# Altium schematic sheet Sheet4.SchDoc
size A3
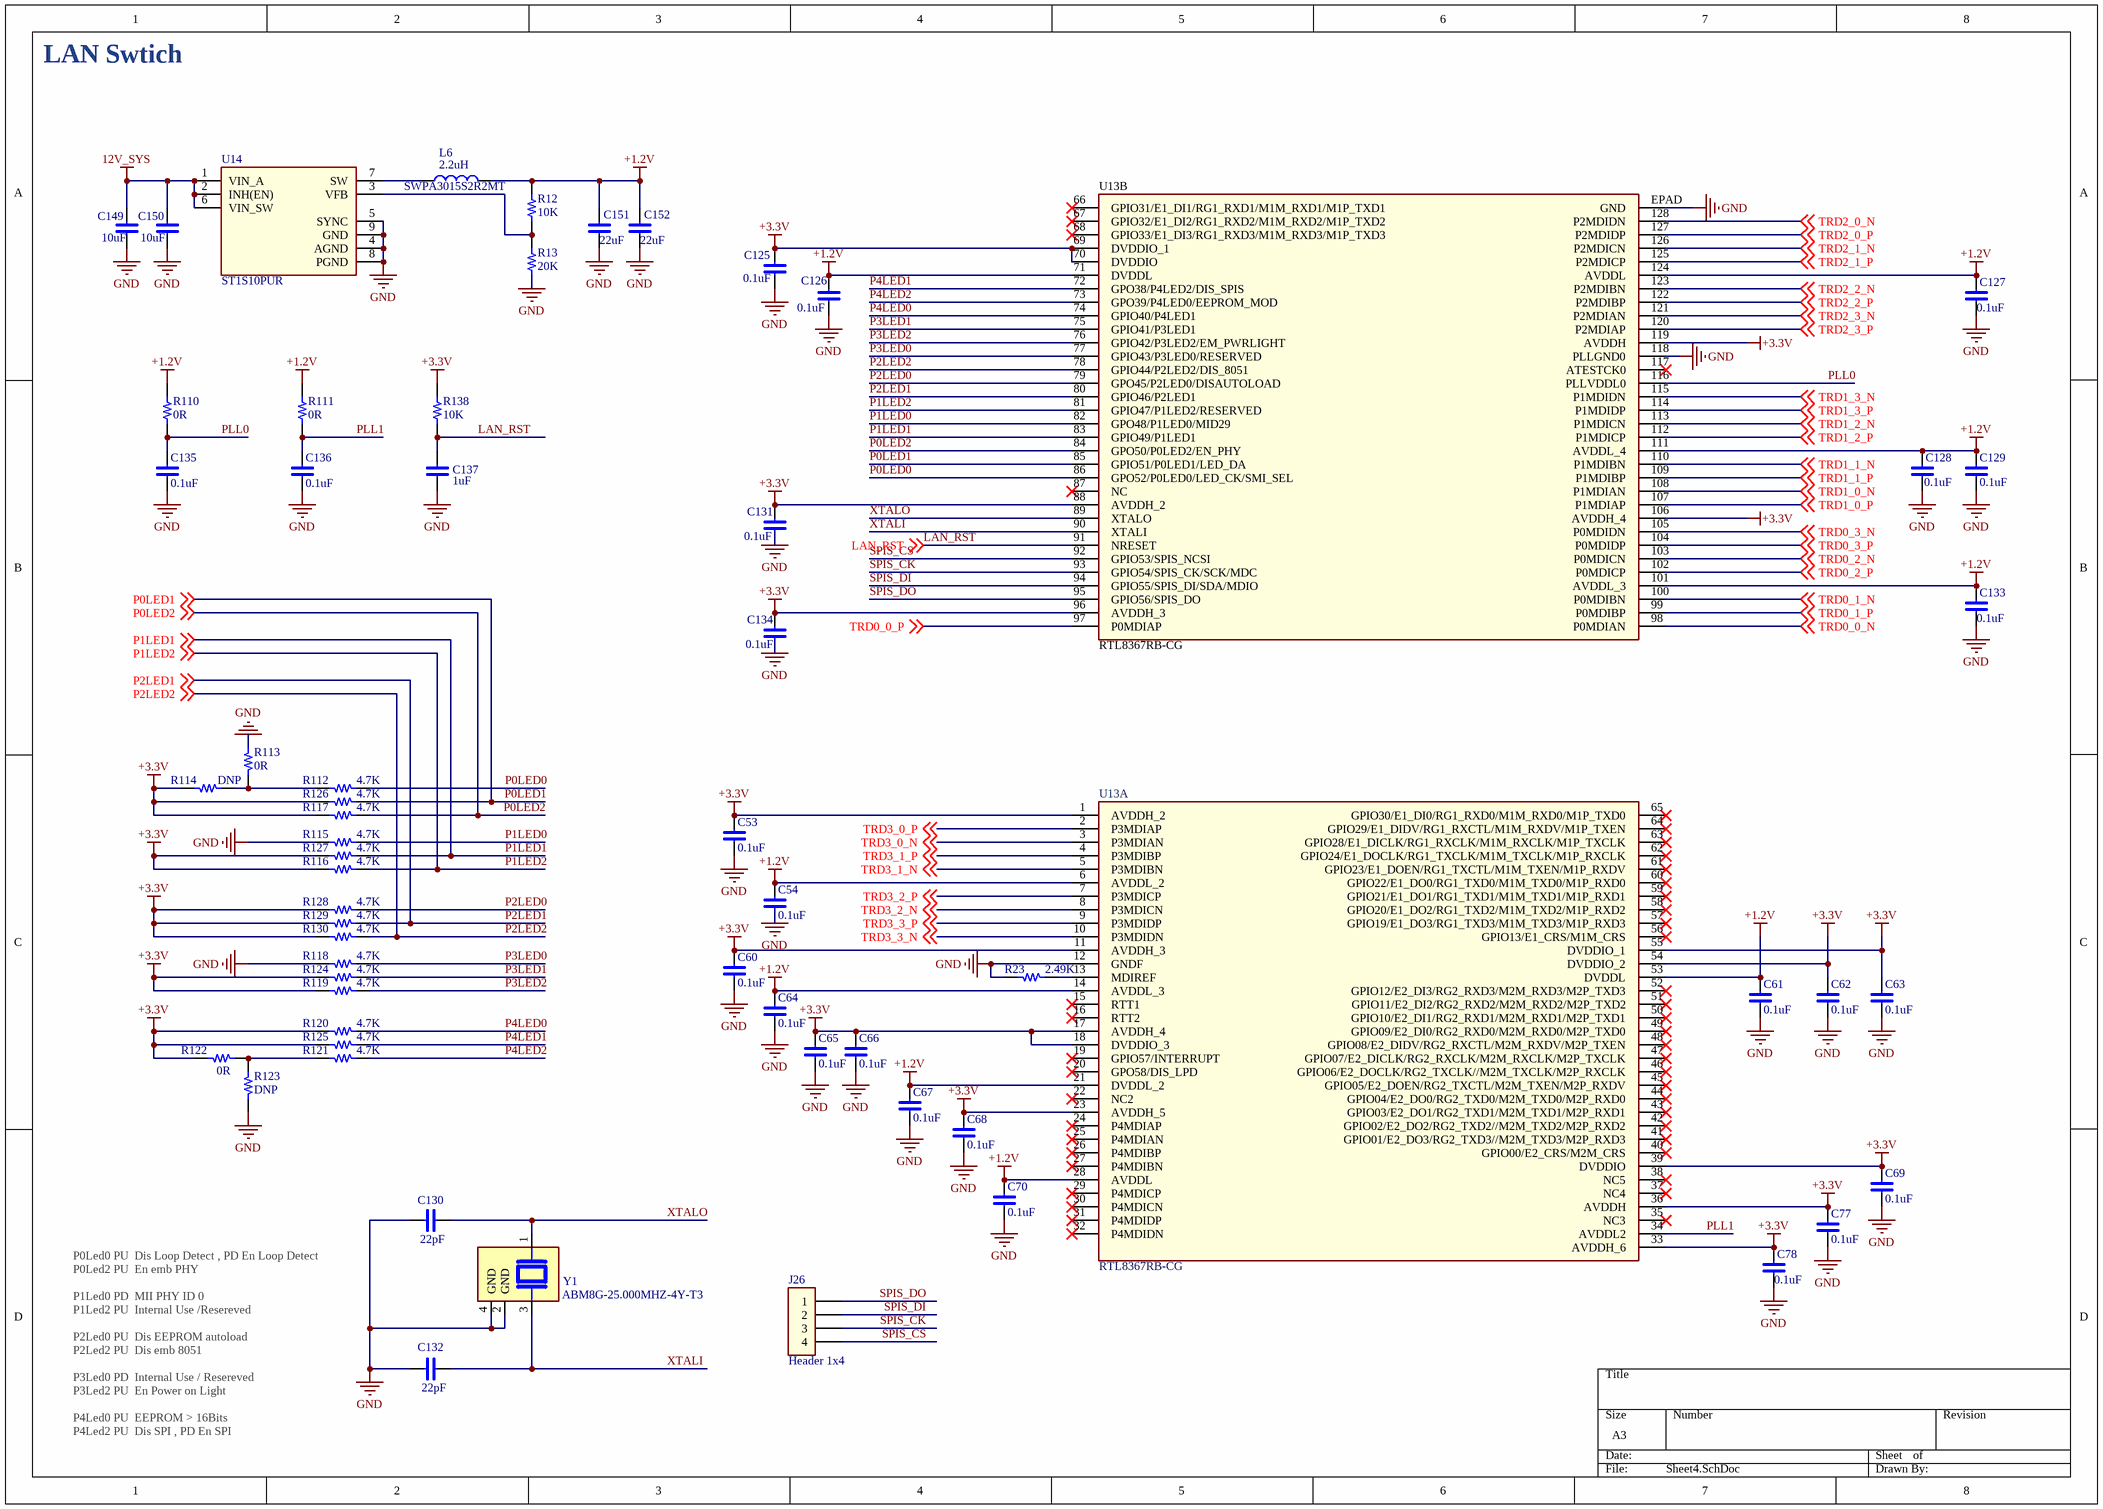
[diagram p0: Sheet4.SchDoc]

## Parts
C53  0.1uF  [C-0402/1005]
C54  0.1uF  [C-0402/1005]
C60  0.1uF  [C-0402/1005]
C61  0.1uF  [C-0402/1005]
C62  0.1uF  [C-0402/1005]
C63  0.1uF  [C-0402/1005]
C64  0.1uF  [C-0402/1005]
C65  0.1uF  [C-0402/1005]
C66  0.1uF  [C-0402/1005]
C67  0.1uF  [C-0402/1005]
C68  0.1uF  [C-0402/1005]
C69  0.1uF  [C-0402/1005]
C70  0.1uF  [C-0402/1005]
C77  0.1uF  [C-0402/1005]
C78  0.1uF  [C-0402/1005]
C125  0.1uF  [C-0402/1005]
C126  0.1uF  [C-0402/1005]
C127  0.1uF  [C-0402/1005]
C128  0.1uF  [C-0402/1005]
C129  0.1uF  [C-0402/1005]
C130  22pF  [C-0402/1005]
C131  0.1uF  [C-0402/1005]
C132  22pF  [C-0402/1005]
C133  0.1uF  [C-0402/1005]
C134  0.1uF  [C-0402/1005]
C135  0.1uF  [C-0402/1005]
C136  0.1uF  [C-0402/1005]
C137  1uF  [C-0402/1005]
C149  10uF  [C-0805/2012]
C150  10uF  [C-0805/2012]
C151  22uF  [C-0805/2012]
C152  22uF  [C-0805/2012]
J26  Header 1x4  [PIN HEADER 1x4 2.54mm]
L6  SWPA3015S2R2MT  value 2.2uH  [SWPA3015S2R2MT]
R12  10K  [R-0402/1005]
R13  20K  [R-0402/1005]
R23  2.49K  [R-0402/1005]
R110  0R  [R-0402/1005]
R111  0R  [R-0402/1005]
R112  4.7K  [R-0402/1005]
R113  0R  [R-0402/1005]
R114  DNP  [R-0402/1005]
R115  4.7K  [R-0402/1005]
R116  4.7K  [R-0402/1005]
R117  4.7K  [R-0402/1005]
R118  4.7K  [R-0402/1005]
R119  4.7K  [R-0402/1005]
R120  4.7K  [R-0402/1005]
R121  4.7K  [R-0402/1005]
R122  0R  [R-0402/1005]
R123  DNP  [R-0402/1005]
R124  4.7K  [R-0402/1005]
R125  4.7K  [R-0402/1005]
R126  4.7K  [R-0402/1005]
R127  4.7K  [R-0402/1005]
R128  4.7K  [R-0402/1005]
R129  4.7K  [R-0402/1005]
R130  4.7K  [R-0402/1005]
R138  10K  [R-0402/1005]
U13  RTL8367RB-CG  [LQFP128_EPAD_RTK]  (parts A,B of 2)
U14  ST1S10PUR  [DFN8_4X4_STM]
Y1  ABM8G-25.000MHZ-4Y-T3  [XTAL_ABM8G-25.000MHZ-4Y-T3]

## Nets
12V_SYS: C149.1 C150.1 U14.1(VIN_A) U14.2(INH(EN)) U14.6(VIN_SW)
+1.2V: C54.1 C61.1 C64.1 C67.1 C70.1 C126.1 C127.1 C128.1 C129.1 C133.1 C151.1 C152.1 L6.2 R12.2 R110.2 R111.2 U13.6(AVDDL_2) U13.14(AVDDL_3) U13.21(DVDDL_2) U13.28(AVDDL) U13.53(DVDDL) U13.71(DVDDL) U13.101(AVDDL_3) U13.111(AVDDL_4) U13.124(AVDDL)
+3.3V: C53.1 C60.1 C62.1 C63.1 C65.1 C66.1 C68.1 C69.1 C77.1 C78.1 C125.1 C131.1 C134.1 R114.2 R116.2 R117.2 R119.2 R120.2 R122.2 R124.2 R125.2 R126.2 R127.2 R128.2 R129.2 R130.2 R138.2 U13.1(AVDDH_2) U13.11(AVDDH_3) U13.17(AVDDH_4) U13.18(DVDDIO_3) U13.23(AVDDH_5) U13.33(AVDDH_6) U13.36(AVDDH) U13.39(DVDDIO) U13.54(DVDDIO_2) U13.55(DVDDIO_1) U13.69(DVDDIO_1) U13.70(DVDDIO) U13.88(AVDDH_2) U13.96(AVDDH_3) U13.106(AVDDH_4) U13.119(AVDDH)
GND: C53.2 C54.2 C60.2 C61.2 C62.2 C63.2 C64.2 C65.2 C66.2 C67.2 C68.2 C69.2 C70.2 C77.2 C78.2 C125.2 C126.2 C127.2 C128.2 C129.2 C130.1 C131.2 C132.1 C133.2 C134.2 C135.2 C136.2 C137.2 C149.2 C150.2 C151.2 C152.2 R13.2 R23.2 R113.2 R115.2 R118.2 R123.2 U13.12(GNDF) U13.118(PLLGND0) U13.EPAD(GND) U14.4(AGND) U14.5(SYNC) U14.8(PGND) U14.9(GND) Y1.2(GND) Y1.4(GND)
LAN_RST: C137.1 R138.1 U13.91(NRESET) ; off-sheet LAN_RST
P0LED0: R112.1 U13.86(GPO52/P0LED0/LED_CK/SMI_SEL)
P0LED1: R126.1 U13.85(GPIO51/P0LED1/LED_DA) ; off-sheet P0LED1
P0LED2: R117.1 U13.84(GPO50/P0LED2/EN_PHY) ; off-sheet P0LED2
P1LED0: R115.1 U13.82(GPO48/P1LED0/MID29)
P1LED1: R127.1 U13.83(GPIO49/P1LED1) ; off-sheet P1LED1
P1LED2: R116.1 U13.81(GPIO47/P1LED2/RESERVED) ; off-sheet P1LED2
P2LED0: R128.1 U13.79(GPO45/P2LED0/DISAUTOLOAD)
P2LED1: R129.1 U13.80(GPIO46/P2LED1) ; off-sheet P2LED1
P2LED2: R130.1 U13.78(GPIO44/P2LED2/DIS_8051) ; off-sheet P2LED2
P3LED0: R118.1 U13.77(GPIO43/P3LED0/RESERVED)
P3LED1: R124.1 U13.75(GPIO41/P3LED1)
P3LED2: R119.1 U13.76(GPIO42/P3LED2/EM_PWRLIGHT)
P4LED0: R120.1 U13.74(GPIO40/P4LED1)
P4LED1: R125.1 U13.72(GPO38/P4LED2/DIS_SPIS)
P4LED2: R121.1 U13.73(GPO39/P4LED0/EEPROM_MOD)
PLL0: C135.1 R110.1 U13.116(PLLVDDL0)
PLL1: C136.1 R111.1 U13.34(AVDDL2)
SPIS_CK: J26.3 U13.93(GPIO54/SPIS_CK/SCK/MDC)
SPIS_CS: J26.4 U13.92(GPIO53/SPIS_NCSI)
SPIS_DI: J26.2 U13.94(GPIO55/SPIS_DI/SDA/MDIO)
SPIS_DO: J26.1 U13.95(GPIO56/SPIS_DO)
TRD0_0_N: U13.98(P0MDIAN) ; off-sheet TRD0_0_N
TRD0_0_P: U13.97(P0MDIAP) ; off-sheet TRD0_0_P
TRD0_1_N: U13.100(P0MDIBN) ; off-sheet TRD0_1_N
TRD0_1_P: U13.99(P0MDIBP) ; off-sheet TRD0_1_P
TRD0_2_N: U13.103(P0MDICN) ; off-sheet TRD0_2_N
TRD0_2_P: U13.102(P0MDICP) ; off-sheet TRD0_2_P
TRD0_3_N: U13.105(P0MDIDN) ; off-sheet TRD0_3_N
TRD0_3_P: U13.104(P0MDIDP) ; off-sheet TRD0_3_P
TRD1_0_N: U13.108(P1MDIAN) ; off-sheet TRD1_0_N
TRD1_0_P: U13.107(P1MDIAP) ; off-sheet TRD1_0_P
TRD1_1_N: U13.110(P1MDIBN) ; off-sheet TRD1_1_N
TRD1_1_P: U13.109(P1MDIBP) ; off-sheet TRD1_1_P
TRD1_2_N: U13.113(P1MDICN) ; off-sheet TRD1_2_N
TRD1_2_P: U13.112(P1MDICP) ; off-sheet TRD1_2_P
TRD1_3_N: U13.115(P1MDIDN) ; off-sheet TRD1_3_N
TRD1_3_P: U13.114(P1MDIDP) ; off-sheet TRD1_3_P
TRD2_0_N: U13.128(P2MDIDN) ; off-sheet TRD2_0_N
TRD2_0_P: U13.127(P2MDIDP) ; off-sheet TRD2_0_P
TRD2_1_N: U13.126(P2MDICN) ; off-sheet TRD2_1_N
TRD2_1_P: U13.125(P2MDICP) ; off-sheet TRD2_1_P
TRD2_2_N: U13.123(P2MDIBN) ; off-sheet TRD2_2_N
TRD2_2_P: U13.122(P2MDIBP) ; off-sheet TRD2_2_P
TRD2_3_N: U13.121(P2MDIAN) ; off-sheet TRD2_3_N
TRD2_3_P: U13.120(P2MDIAP) ; off-sheet TRD2_3_P
TRD3_0_N: U13.3(P3MDIAN) ; off-sheet TRD3_0_N
TRD3_0_P: U13.2(P3MDIAP) ; off-sheet TRD3_0_P
TRD3_1_N: U13.5(P3MDIBN) ; off-sheet TRD3_1_N
TRD3_1_P: U13.4(P3MDIBP) ; off-sheet TRD3_1_P
TRD3_2_N: U13.8(P3MDICN) ; off-sheet TRD3_2_N
TRD3_2_P: U13.7(P3MDICP) ; off-sheet TRD3_2_P
TRD3_3_N: U13.10(P3MDIDN) ; off-sheet TRD3_3_N
TRD3_3_P: U13.9(P3MDIDP) ; off-sheet TRD3_3_P
XTALI: C132.2 U13.90(XTALI) Y1.3
XTALO: C130.2 U13.89(XTALO) Y1.1
NetL6_1: L6.1 U14.7(SW)
NetR12_1: R12.1 R13.1 U14.3(VFB)
NetR23_1: R23.1 U13.13(MDIREF)
NetR112_2: R112.2 R113.1 R114.1
NetR121_2: R121.2 R122.1 R123.1

Not connected (* = marked no-connect by the designer): U13 15(RTT1)* 16(RTT2)* 19(GPIO57/INTERRUPT)* 20(GPO58/DIS_LPD)* 22(NC2)* 24(P4MDIAP)* 25(P4MDIAN)* 26(P4MDIBP)* 27(P4MDIBN)* 29(P4MDICP)* 30(P4MDICN)* 31(P4MDIDP)* 32(P4MDIDN)* 35(NC3)* 37(NC4)* 38(NC5)* 40(GPIO00/E2_CRS/M2M_CRS)* 41(GPIO01/E2_DO3/RG2_TXD3//M2M_TXD3/M2P_RXD3)* 42(GPIO02/E2_DO2/RG2_TXD2//M2M_TXD2/M2P_RXD2)* 43(GPIO03/E2_DO1/RG2_TXD1/M2M_TXD1/M2P_RXD1)* 44(GPIO04/E2_DO0/RG2_TXD0/M2M_TXD0/M2P_RXD0)* 45(GPIO05/E2_DOEN/RG2_TXCTL/M2M_TXEN/M2P_RXDV)* 46(GPIO06/E2_DOCLK/RG2_TXCLK//M2M_TXCLK/M2P_RXCLK)* 47(GPIO07/E2_DICLK/RG2_RXCLK/M2M_RXCLK/M2P_TXCLK)* 48(GPIO08/E2_DIDV/RG2_RXCTL/M2M_RXDV/M2P_TXEN)* 49(GPIO09/E2_DI0/RG2_RXD0/M2M_RXD0/M2P_TXD0)* 50(GPIO10/E2_DI1/RG2_RXD1/M2M_RXD1/M2P_TXD1)* 51(GPIO11/E2_DI2/RG2_RXD2/M2M_RXD2/M2P_TXD2)* 52(GPIO12/E2_DI3/RG2_RXD3/M2M_RXD3/M2P_TXD3)* 56(GPIO13/E1_CRS/M1M_CRS)* 57(GPIO19/E1_DO3/RG1_TXD3/M1M_TXD3/M1P_RXD3)* 58(GPIO20/E1_DO2/RG1_TXD2/M1M_TXD2/M1P_RXD2)* 59(GPIO21/E1_DO1/RG1_TXD1/M1M_TXD1/M1P_RXD1)* 60(GPIO22/E1_DO0/RG1_TXD0/M1M_TXD0/M1P_RXD0)* 61(GPIO23/E1_DOEN/RG1_TXCTL/M1M_TXEN/M1P_RXDV)* 62(GPIO24/E1_DOCLK/RG1_TXCLK/M1M_TXCLK/M1P_RXCLK)* 63(GPIO28/E1_DICLK/RG1_RXCLK/M1M_RXCLK/M1P_TXCLK)* 64(GPIO29/E1_DIDV/RG1_RXCTL/M1M_RXDV/M1P_TXEN)* 65(GPIO30/E1_DI0/RG1_RXD0/M1M_RXD0/M1P_TXD0)* 66(GPIO31/E1_DI1/RG1_RXD1/M1M_RXD1/M1P_TXD1)* 67(GPIO32/E1_DI2/RG1_RXD2/M1M_RXD2/M1P_TXD2)* 68(GPIO33/E1_DI3/RG1_RXD3/M1M_RXD3/M1P_TXD3)* 87(NC)* 117(ATESTCK0)*

## Notes on the sheet
- LAN Swtich
- P0Led0 PU  Dis Loop Detect , PD En Loop Detect
  P0Led2 PU  En emb PHY
  P1Led0 PD  MII PHY ID 0
  P1Led2 PU  Internal Use /Resereved
  P2Led0 PU  Dis EEPROM autoload
  P2Led2 PU  Dis emb 8051
  P3Led0 PD  Internal Use / Resereved
  P3Led2 PU  En Power on Light
  P4Led0 PU  EEPROM > 16Bits
  P4Led2 PU  Dis SPI , PD En SPI

## Library data of the parts
C53 C54 C60-C70 C77 C78 C125-C137 = Capacitor-NonPolar: CAP CER 0.1UF 16V X7R 0402; Mfr. Part No.: GCM155R71C104KA55D; Unit Price (USD): 0.1; Value: 0.1uF 16V; Supplier Part No.: 490-4759-1-ND; Supplier: Digikey Electronics
C149-C152 = CAP 1206/3216: CAP CER 10UF 25V X5R 1206; Mfr. Part No.: C1206C106M3PACTU; Unit Price (USD): 0.28; Supplier Part No.: 399-8153-1-ND; Supplier: Digikey Electronics
J26 = Header 1x4: CONN HEADER VERT 4POS 2.54MM; Supplier: Digikey Electronics
L6 = 4.3x4.3mm: FIXED IND 22UH 620MA 350 MOHM; Mfr. Part No.: ASPI-4020S-220M-T; Unit Price (USD): 0.48; Supplier Part No.: 535-12307-1-ND; Supplier: Digikey Electronics
R12 R13 R23 = Resistor: RES SMD 51 OHM 0.5% 1/16W 0402; Mfr. Part No.: ERA-2AED510X; Value: 51R; Unit Price (USD): 0.21; Supplier Part No.: P51DECT-ND; Supplier: Digikey Electronics
R110-R130 R138 = Resistor: RES SMD 1K OHM 1% 1/16W 0402; Mfr. Part No.: RC0402FR-071KL; Unit Price (USD): 0.1; Value: 1k; Supplier Part No.: 311-1.00KLRCT-ND; Supplier: Digikey Electronics
U13 = RTL8367RB-CG: MFR_NAME: Realtek; GateName_1: A; SymbolName_1: RTL8367RB-CG_PARTA; GateName_2: B; SymbolName_2: RTL8367RB-CG_PARTB; LibraryName: RTL8367RB; DeviceSetName: RTL8367RB-CG; Package: LQFP128_EPAD_RTK; COPYRIGHT: Copyright (C) 2023 Ultra Librarian. All rights reserved.; MANUFACTURER_PART_NUMBER: RTL8367RB-CG
U14 = ST1S10PUR: No Description Available; Mfr_Name: STMicroelectronics; RefDes: RefDes; Type: Type
Y1 = ABM8G-25.000MHZ-4Y-T3: 25 MHz Â±30ppm Crystal 10pF 60 Ohms 4-SMD, No Lead; MF: Abracon; Price: None; Value: *; Check_prices: https://www.snapeda.com/parts/ABM8G-25.000MHZ-4Y-T3/Abracon+LLC/view-part/?ref=eda; Purchase-URL: https://pricing.snapeda.com/search/part/ABM8G-25.000MHZ-4Y-T3/?ref=eda; Package: SMD-4 Abracon; SnapEDA_Link: https://www.snapeda.com/parts/ABM8G-25.000MHZ-4Y-T3/Abracon+LLC/view-part/?ref=snap; Availability: In Stock; MP: ABM8G-25.000MHZ-4Y-T3